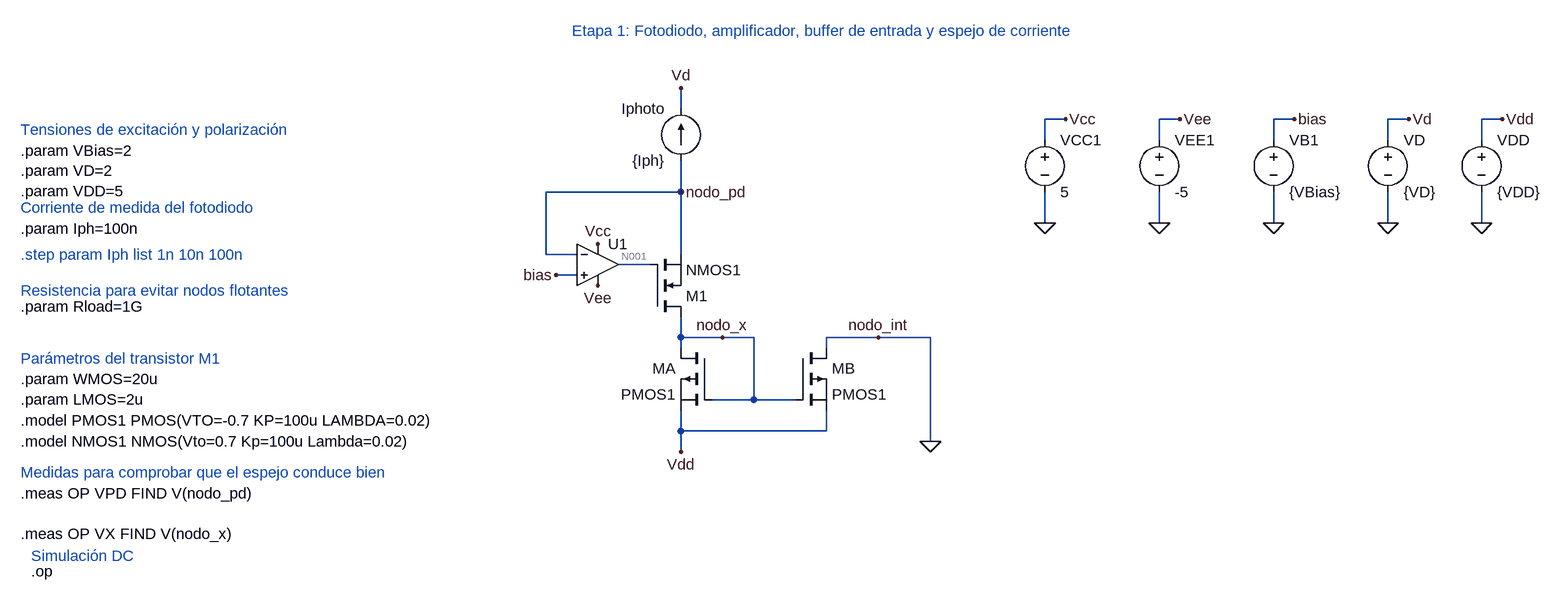
[diagram p0: schematic BGMI_Etapa1.asc]
BGMI_Etapa1.asc, the LTspice schematic file:
Version 4.1
SHEET 1 1524 680
WIRE 64 -384 64 -416
WIRE 656 -368 624 -368
WIRE 832 -368 800 -368
WIRE 1008 -368 976 -368
WIRE 1184 -368 1152 -368
WIRE 1328 -368 1296 -368
WIRE 624 -336 624 -368
WIRE 800 -336 800 -368
WIRE 976 -336 976 -368
WIRE 1152 -336 1152 -368
WIRE 1296 -336 1296 -368
WIRE 64 -256 64 -304
WIRE 64 -256 -144 -256
WIRE 624 -208 624 -256
WIRE 800 -208 800 -256
WIRE 976 -208 976 -256
WIRE 1152 -208 1152 -256
WIRE 1296 -208 1296 -256
WIRE -144 -160 -144 -256
WIRE -96 -160 -144 -160
WIRE 64 -160 64 -256
WIRE 16 -144 -32 -144
WIRE -96 -128 -128 -128
WIRE 64 -32 64 -64
WIRE 128 -32 64 -32
WIRE 176 -32 128 -32
WIRE 368 -32 288 -32
WIRE 448 -32 368 -32
WIRE 64 -16 64 -32
WIRE 288 -16 288 -32
WIRE 176 64 176 -32
WIRE 176 64 112 64
WIRE 240 64 176 64
WIRE 64 112 64 80
WIRE 288 112 288 80
WIRE 288 112 64 112
WIRE 448 128 448 -32
WIRE 64 144 64 112
FLAG 1152 -208 0
FLAG 64 -256 nodo_pd
FLAG -64 -176 Vcc
FLAG -64 -112 Vee
FLAG -128 -128 bias
FLAG 1008 -368 bias
FLAG 624 -208 0
FLAG 800 -208 0
FLAG 656 -368 Vcc
FLAG 832 -368 Vee
FLAG 976 -208 0
FLAG 1184 -368 Vd
FLAG 64 -416 Vd
FLAG 128 -32 nodo_x
FLAG 448 128 0
FLAG 368 -32 nodo_int
FLAG 1296 -208 0
FLAG 1328 -368 Vdd
FLAG 64 144 Vdd
SYMBOL current 64 -304 R180
WINDOW 0 24 80 Left 2
WINDOW 3 24 0 Left 2
WINDOW 123 0 0 Left 0
WINDOW 39 0 0 Left 0
SYMATTR InstName Iphoto
SYMATTR Value {Iph}
SYMBOL voltage 1152 -352 R0
SYMATTR InstName VD
SYMATTR Value {VD}
SYMBOL OpAmps\\UniversalOpAmp2 -64 -144 R0
SYMATTR InstName U1
SYMBOL voltage 976 -352 R0
SYMATTR InstName VB1
SYMATTR Value {VBias}
SYMBOL voltage 624 -352 R0
SYMATTR InstName VCC1
SYMATTR Value 5
SYMBOL voltage 800 -352 R0
SYMATTR InstName VEE1
SYMATTR Value -5
SYMBOL nmos 16 -64 M180
SYMATTR InstName M1
SYMATTR Value NMOS1
SYMATTR SpiceLine L={LMOS} W={WMOS}
SYMBOL pmos 240 -16 R0
SYMATTR InstName MB
SYMATTR Value PMOS1
SYMATTR SpiceLine L={LMOS} W={WMOS}
SYMBOL pmos 112 -16 M0
SYMATTR InstName MA
SYMATTR Value PMOS1
SYMATTR SpiceLine L={LMOS} W={WMOS}
SYMBOL voltage 1296 -352 R0
SYMATTR InstName VDD
SYMATTR Value {VDD}
TEXT -104 -504 Left 2 ;Etapa 1: Fotodiodo, amplificador, buffer de entrada y espejo de corriente
TEXT -952 -232 Left 2 ;Corriente de medida del fotodiodo
TEXT -952 -200 Left 2 !.param Iph=100n
TEXT -952 -160 Left 2 ;.step param Iph list 1n 10n 100n
TEXT -952 -352 Left 2 ;Tensiones de excitación y polarización
TEXT -952 -320 Left 2 !.param VBias=2\n.param VD=2\n.param VDD=5
TEXT -952 96 Left 2 !.model PMOS1 PMOS(VTO=-0.7 KP=100u LAMBDA=0.02)
TEXT -952 32 Left 2 !.param WMOS=20u\n.param LMOS=2u
TEXT -952 0 Left 2 ;Parámetros del transistor M1
TEXT -952 128 Left 2 !.model NMOS1 NMOS(Vto=0.7 Kp=100u Lambda=0.02)
TEXT -936 328 Left 2 !.op
TEXT -936 304 Left 2 ;Simulación DC
TEXT -952 208 Left 2 !.meas OP VPD FIND V(nodo_pd)\n\n.meas OP VX FIND V(nodo_x)
TEXT -952 176 Left 2 ;Medidas para comprobar que el espejo conduce bien
TEXT -952 -104 Left 2 ;Resistencia para evitar nodos flotantes
TEXT -952 -80 Left 2 !.param Rload=1G

The netlist it stands for:
* BGMI_Etapa1.asc
Iphoto nodo_pd Vd {Iph}
VD Vd 0 {VD}
X§U1 bias nodo_pd Vcc Vee N001 level2 Avol=1Meg GBW=10Meg Slew=10Meg Ilimit=25m Rail=0 Vos=0 En=0 Enk=0 In=0 Ink=0 Rin=500Meg  ; pins In+ In- V+ V- OUT
VB1 bias 0 {VBias}
VCC1 Vcc 0 5
VEE1 Vee 0 -5
M1 nodo_x N001 nodo_pd nodo_pd NMOS1 L={LMOS} W={WMOS}
MB 0 nodo_x Vdd Vdd PMOS1 L={LMOS} W={WMOS}
MA nodo_x nodo_x Vdd Vdd PMOS1 L={LMOS} W={WMOS}
VDD Vdd 0 {VDD}
.model NMOS NMOS
.model PMOS PMOS
.lib standard.mos
* Etapa 1: Fotodiodo, amplificador, buffer de entrada y espejo de corriente
* Corriente de medida del fotodiodo
.param Iph=100n
* .step param Iph list 1n 10n 100n
* Tensiones de excitación y polarización
.param VBias=2
.param VD=2
.param VDD=5
.model PMOS1 PMOS(VTO=-0.7 KP=100u LAMBDA=0.02)
.param WMOS=20u
.param LMOS=2u
* Parámetros del transistor M1
.model NMOS1 NMOS(Vto=0.7 Kp=100u Lambda=0.02)
.op
* Simulación DC
.meas OP VPD FIND V(nodo_pd)
.meas OP VX FIND V(nodo_x)
* Medidas para comprobar que el espejo conduce bien
* Resistencia para evitar nodos flotantes
.param Rload=1G
.lib UniversalOpAmp2.lib
.backanno
.end

* Results of the author's LTspice run, read from the files saved beside the schematic
* Operating Point:
*   V(bias) = 2 V
*   V(n001) = 2.714 V
*   V(nodo_pd) = 2 V
*   V(nodo_x) = 4.286 V
*   V(vcc) = 5 V
*   V(vd) = 2 V
*   V(vdd) = 5 V
*   V(vee) = -5 V
*   I(Iphoto) = 100 nA
*   I(VB1) = -4 nA
*   I(VCC1) = -419.9 µA
*   I(VD) = 100 nA
*   I(VDD) = -216.8 nA
*   I(VEE1) = 419.9 µA
*   Ib(M1) = -2.296 pA
*   Ib(MA) = 724.3 fA
*   Ib(MB) = 5.01 pA
*   Id(M1) = 104 nA
*   Id(MA) = -104 nA
*   Id(MB) = -112.8 nA
*   Ig(M1) = 0 A
*   Ig(MA) = 0 A
*   Ig(MB) = 0 A
*   Is(M1) = -104 nA
*   Is(MA) = 104 nA
*   Is(MB) = 112.8 nA
*   Ix(u1:1) = 4 nA
*   Ix(u1:2) = 4 nA
*   Ix(u1:3) = 419.9 µA
*   Ix(u1:4) = -419.9 µA
*   Ix(u1:5) = 0 A
* From the log:
*   vpd: V(nodo_pd)=1.99999725819 at 2
*   vx: V(nodo_x)=4.2856798172 at 2